# EAGLE schematic Ultrasonics (EAGLE 9.4.2)
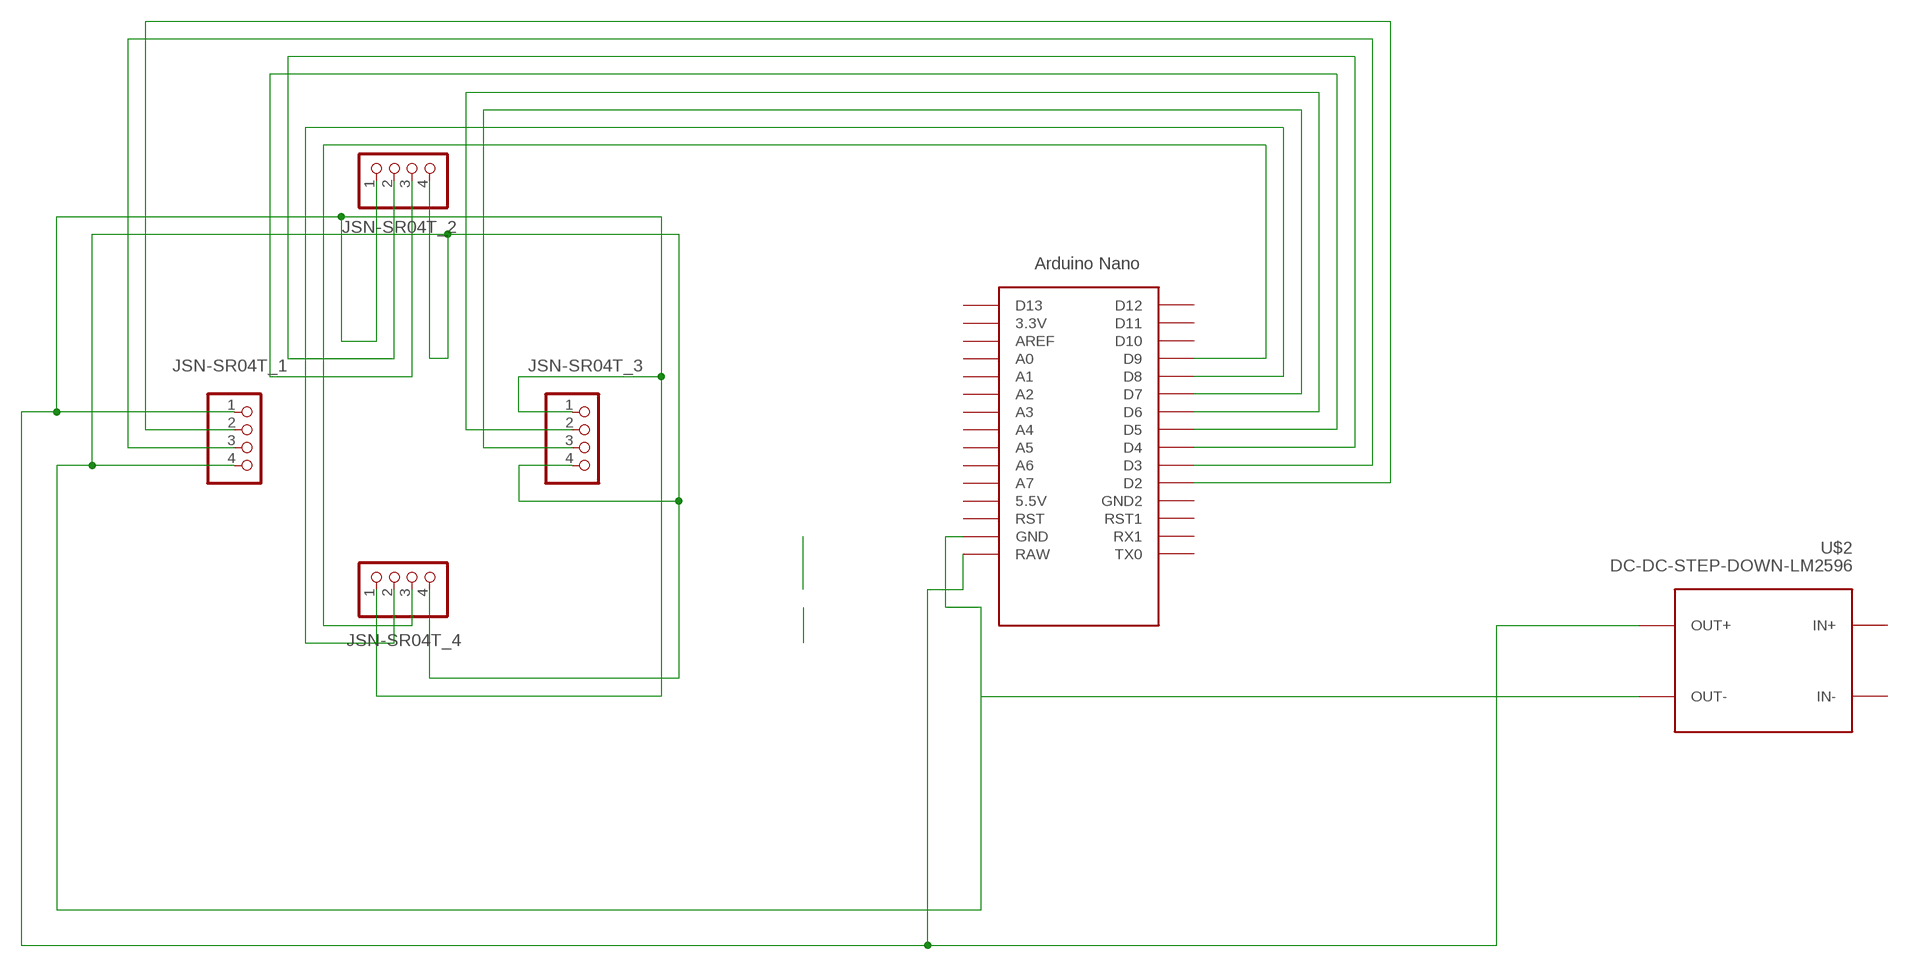
[diagram p0: schematic, sheet 1]

## Parts
JSN-SR04T_1  PINHD-1X4  [1X04]
JSN-SR04T_2  PINHD-1X4  [1X04]
JSN-SR04T_3  PINHD-1X4  [1X04]
JSN-SR04T_4  PINHD-1X4  [1X04]
U$1  NANO  [NANO]
U$2  DC-DC-STEP-DOWN-LM2596  [DC-DC-STEP-DOWN-LM2596]

## Nets
N$1: JSN-SR04T_1.1 JSN-SR04T_2.1 JSN-SR04T_3.1 JSN-SR04T_4.1 U$1.RAW U$2.OUT+
N$2: JSN-SR04T_4.3 U$1.D9
N$3: JSN-SR04T_1.2 U$1.D2
N$4: JSN-SR04T_1.3 U$1.D3
N$5: JSN-SR04T_2.2 U$1.D4
N$6: JSN-SR04T_2.3 U$1.D5
N$7: JSN-SR04T_3.2 U$1.D6
N$8: JSN-SR04T_3.3 U$1.D7
N$9: JSN-SR04T_4.2 U$1.D8
N$10: JSN-SR04T_1.4 JSN-SR04T_2.4 JSN-SR04T_3.4 JSN-SR04T_4.4 U$1.GND U$2.OUT-
Unconnected: U$1.3.3V U$1.5V(5.5V) U$1.A0 U$1.A1 U$1.A2 U$1.A3 U$1.A4 U$1.A5 U$1.A6 U$1.A7 U$1.AREF U$1.D10 U$1.D11 U$1.D12 U$1.D13 U$1.GND1(GND2) U$1.ICSP1 U$1.ICSP2 U$1.ICSP3 U$1.ICSP4 U$1.ICSP5 U$1.ICSP6 U$1.RST U$1.RST1 U$1.RX1 U$1.TX0 U$2.IN+ U$2.IN-

## Library data of the parts
JSN-SR04T_1-JSN-SR04T_4 = pinhead:PINHD-1X4: PIN HEADER
U$1 = Arduino-clone:NANO: Arduino Nano
U$2 = diy-modules:DC-DC-STEP-DOWN-LM2596: DC/DC Step-Down Regulator based on LM2596-ADJ chip LM2596 datasheet available here: http://www.ti.com/lit/ds/symlink/lm2596.pdf Click here to find device on ebay.com <http://www.ebay.com/sch/lm2596+power+regulator>